# Altium schematic sheet Sheet2.SchDoc
size A4; SheetNumber: 1; SheetTotal: 3
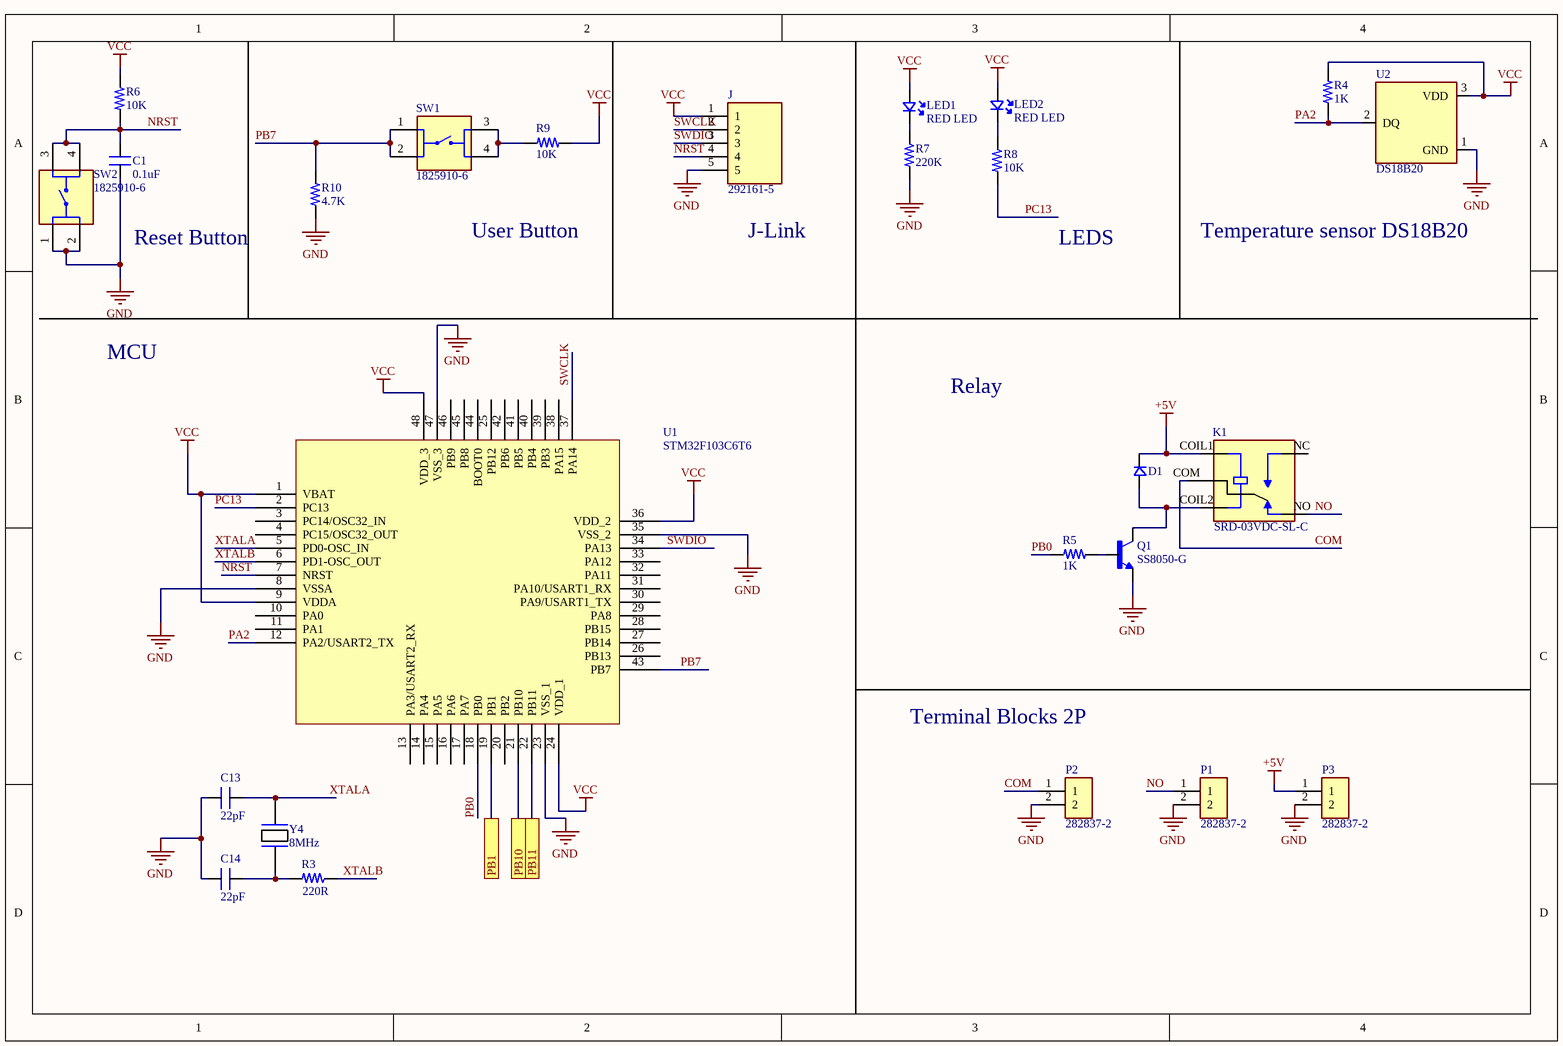
[diagram p0: Sheet2.SchDoc]

## Parts
C1  0.1uF  [CAP_0805]
C13  22pF  [CAP_0805]
C14  22pF  [CAP_0805]
D1  (no value)  [DIOAD829W49L456D191]
J  292161-5  [TE_292161-5]
K1  SRD-03VDC-SL-C  [RELAY_SRD-03VDC-SL-C]
LED1  RED LED  [LED_0805]
LED2  RED LED  [LED_0805]
P1  282837-2  [TE_282837-2]
P2  282837-2  [TE_282837-2]
P3  282837-2  [TE_282837-2]
Q1  SS8050-G  [TRANS_SS8050-G]
R3  220R  [RES_0805]
R4  1K  [RES_0805]
R5  1K  [RES_0805]
R6  10K  [RES_0805]
R7  220K  [RES_0805]
R8  10K  [RES_0805]
R9  10K  [RES_0805]
R10  4.7K  [RES_0805]
SW1  1825910-6  [SW_1825910-6-4]
SW2  1825910-6  [SW_1825910-6-4]
U1  STM32F103C6T6  [LQFP-48_19.6_393_58X11_SMD]
U2  DS18B20  [TO-92-TO92127P495H2044-3]
Y4  8MHz  [XTAL_314_240X47_SMD]

## Ports
PB1, PB10, PB11

## Nets
+5V: D1.C K1.COIL1 P3.1
GND: C1.1 C13.1 C14.1 J.5 P1.2 P2.2 P3.2 Q1.2(E) R7.1 R10.1 SW2.1 SW2.2 U1.8(VSSA) U1.23(VSS_1) U1.35(VSS_2) U1.47(VSS_3) U2.1(GND)
VCC: J.1 LED1.A LED2.A R4.2 R6.2 R9.2 U1.1(VBAT) U1.9(VDDA) U1.24(VDD_1) U1.36(VDD_2) U1.48(VDD_3) U2.3(VDD)
COM: K1.COM P2.1
NO: K1.NO P1.1
NRST: C1.2 J.4 R6.1 SW2.3 SW2.4 U1.7(NRST)
PA2: R4.1 U1.12(PA2/USART2_TX) U2.2(DQ)
PB0: R5.1 U1.18(PB0)
PB1: U1.19(PB1) ; port PB1
PB7: R10.2 SW1.1 SW1.2 U1.43(PB7)
PB10: U1.21(PB10) ; port PB10
PB11: U1.22(PB11) ; port PB11
PC13: R8.1 U1.2(PC13)
SWCLK: J.2 U1.37(PA14)
SWDIO: J.3 U1.34(PA13)
XTALA: C13.2 U1.5(PD0-OSC_IN) Y4.1
XTALB: R3.2 U1.6(PD1-OSC_OUT)
NetC14_2: C14.2 R3.1 Y4.2
NetD1_A: D1.A K1.COIL2 Q1.3(C)
NetLED1_K: LED1.K R7.2
NetLED2_K: LED2.K R8.2
NetQ1_1: Q1.1(B) R5.2
NetR9_1: R9.1 SW1.3 SW1.4

Not connected (* = marked no-connect by the designer): K1 NC; U1 3(PC14/OSC32_IN) 4(PC15/OSC32_OUT) 10(PA0) 11(PA1) 13(PA3/USART2_RX) 14(PA4) 15(PA5) 16(PA6) 17(PA7) 20(PB2) 25(PB12) 26(PB13) 27(PB14) 28(PB15) 29(PA8) 30(PA9/USART1_TX) 31(PA10/USART1_RX) 32(PA11) 33(PA12) 38(PA15) 39(PB3) 40(PB4) 41(PB5) 42(PB6) 44(BOOT0) 45(PB8) 46(PB9)

## Notes on the sheet
- Reset Button
- User Button
- (near J) J-Link
- LEDS
- Temperature sensor DS18B20
- MCU
- Relay
- Terminal Blocks 2P

## Library data of the parts
C1 = CAP_0.1uF-50V-5%-0805: 0.1µF ±5% 50V Ceramic Capacitor X7R 0805 (2012 Metric); Manufacturer: KEMET; Manufacturing Part Number: C0805C104J5RACTU; Case/Package: 0805 (2012 Metric); Supplier-1: Digikey; Supplier Part Number-1: 399-1171-1-ND
C13 C14 = CAP_22pF-50V-5%-0805: 22pF ±5% 50V Ceramic Capacitor C0G, NP0 0805 (2012 Metric); Manufacturer: KEMET; Manufacturer Part Number: C0805C220J5GACTU; Case/Package: 0805; Supplier-1: Digikey; Supplier Part Number-1: 399-1113-1-ND
D1 = 1N4148: Diode Standard 75V 200mA Surface Mount SOD-523F
J = 292161-5: Wire-To-Board Connector, Vertical, AMP CT Series, Through Hole, Header, 5, 2 mm; MF: TE Connectivity; SnapEDA_Link: https://www.snapeda.com/parts/292161-5/TE%20Connectivity%20AMP%20Connectors/view-part/779050/?ref=snap; EU_RoHS_Compliance: Compliant; DigiKey-Purchase-URL: https://snapeda.com/shop?store=DigiKey&id=779050; Package: None; Availability: Good; Price: None; Mouser-Purchase-URL: https://snapeda.com/shop?store=Mouser&id=779050; MP: 292161-5; Value: *
K1 = SRD-03VDC-SL-C: Relays General Purpose Non Latching 3VDC SPDT 10A (250VAC) Max 5PIN; MF: Songle Relay; Value: *; Price: None; Package: Package; Availability: Not in stock; Check_prices: https://www.snapeda.com/parts/SRD-03VDC-SL-C/Songle+Relay/view-part/?ref=eda; MP: SRD-03VDC-SL-C; SnapEDA_Link: https://www.snapeda.com/parts/SRD-03VDC-SL-C/Songle+Relay/view-part/?ref=snap
LED1 LED2 = LED-RED_10mA-0805: Red 621nm LED Indication - Discrete 2V 0805 (2012 Metric); Manufacturer: Lite-On Inc.; Manufacturer Part Number: LTST-C170EKT; Case/ Package: 0805; Supplier-1: Digikey; Supplier Part Number-1: 160-1178-1-ND
P1-P3 = 282837-2: Connector Terminal Blocks Receptacle 2 Position 5.08mm Solder Straight Thru-Hole 13.5A/Contact; MF: TE Connectivity; Check_prices: https://www.snapeda.com/parts/282837-2/TE+Connectivity+AMP+Connectors/view-part/?ref=eda; Value: *; Availability: In Stock; MP: 282837-2; Price: None; Package: None; SnapEDA_Link: https://www.snapeda.com/parts/282837-2/TE+Connectivity+AMP+Connectors/view-part/?ref=snap; Purchase-URL: https://pricing.snapeda.com/search/part/282837-2/?ref=eda
Q1 = SS8050-G: Bipolar (BJT) Transistor NPN 25 V 1.5 A 100MHz 300 mW Surface Mount SOT-23-3; MP: SS8050G; MF: Comchip; Digi-Key_Part_Number: 641-1790-2-ND; Check_prices: https://www.snapeda.com/parts/SS8050G/Comchip/view-part/?ref=eda; Package: None; SnapEDA_Link: https://www.snapeda.com/parts/SS8050G/Comchip/view-part/?ref=snap; Value: *
R3 R9 = RES_220R-0.125W-1%-0805_1_1_1: 220 Ohms ±1% 0.125W, 1/8W Chip Resistor 0805 (2012 Metric) Thick Film; Manufacturer: TE Connectivity Passive Product; Manufacturing Part Number: CRG0805F1K5; Case/Package: 0805; Supplier-1: Digikey; Supplier Part Number-1: A106057CT-ND
R4 R10 = RES_4.7K-0.125W-1%-0805: 4.7 kOhms ±1% 0.125W, 1/8W Chip Resistor 0805 (2012 Metric) Thick Film; Manufacturer: TE Connectivity Passive Product; Manufacturing Part Number: CRG0805F1K5; Case/Package: 0805; Supplier-1: Digikey; Supplier Part Number-1: A106057CT-ND
R5 R6 R8 = RES_10K-0.125W-1%-0805: 10 kOhms ±1% 0.125W, 1/8W Chip Resistor 0805 (2012 Metric) Moisture Resistant Thick Film; Manufacturer: Yageo; Manufacturing Part Number: RC0805FR-0710KL; Case/Package: 0805; Supplier-1: Digikey; Supplier Part Number-1: 311-10.0KCRCT-ND
R7 = RES_1K-0.125W-1%-0805: 1 kOhms ±1% 0.125W, 1/8W Chip Resistor 0805 (2012 Metric) Moisture Resistant Thick Film; Manufacturer: 垈㎵á; Manufacturer Part Number: RC0805FR-071KL; Case/Package: 0805; Supplier-1: Digikey; Supplier Part Number-1: 311-1.00KCRCT-ND
SW1 SW2 = 1825910-6: Switch Tactile OFF (ON) SPST Round Button PC Pins 0.05A 24VDC 100000Cycles 1.57N Thru-Hole Loose; Price: None; MP: 1825910-6; Availability: Unavailable; Value: *; Package: None
U1 = IC-STM32F103C6T6 _1: ARM® Cortex®-M3 STM32F1 Microcontroller IC 32-Bit 72MHz 64KB (64K x 8) FLASH; Manufacturer: STMicroelectronics; Manufacturer Part Number: STM32F103C8T6; Case/Package: 48-LQFP; Supplier-1: Digikey; Supplier Part Number-1: 497-6063-ND
U2 = DS18B20: Temperature Sensor Digital, Local -55Â°C ~ 125Â°C 12 b 8-uMAX-EP¦8-uSOP-EP; MF: Maxim; Value: *; SnapEDA_Link: https://www.snapeda.com/parts/DS18B20/Maxim+Integrated/view-part/?ref=snap; Purchase-URL: https://pricing.snapeda.com/search/part/DS18B20/?ref=eda; Availability: In Stock; Price: None; Package: TO-226-3 Maxim; Check_prices: https://www.snapeda.com/parts/DS18B20/Maxim+Integrated/view-part/?ref=eda; MP: DS18B20
Y4 = XTAL_8MHZ-LFXTAL030234: Crystals 8MHz 22pF -20C 70C; Manufacturer: IQD Frequency Products; Manufacturing Part Number: LFXTAL030234Reel; Case/Package: SMD; Supplier-1: Mouser; Supplier Part Number-1: 449-LFXTAL030234REEL